# EAGLE design roboteagle_try2final (EAGLE 5.00)
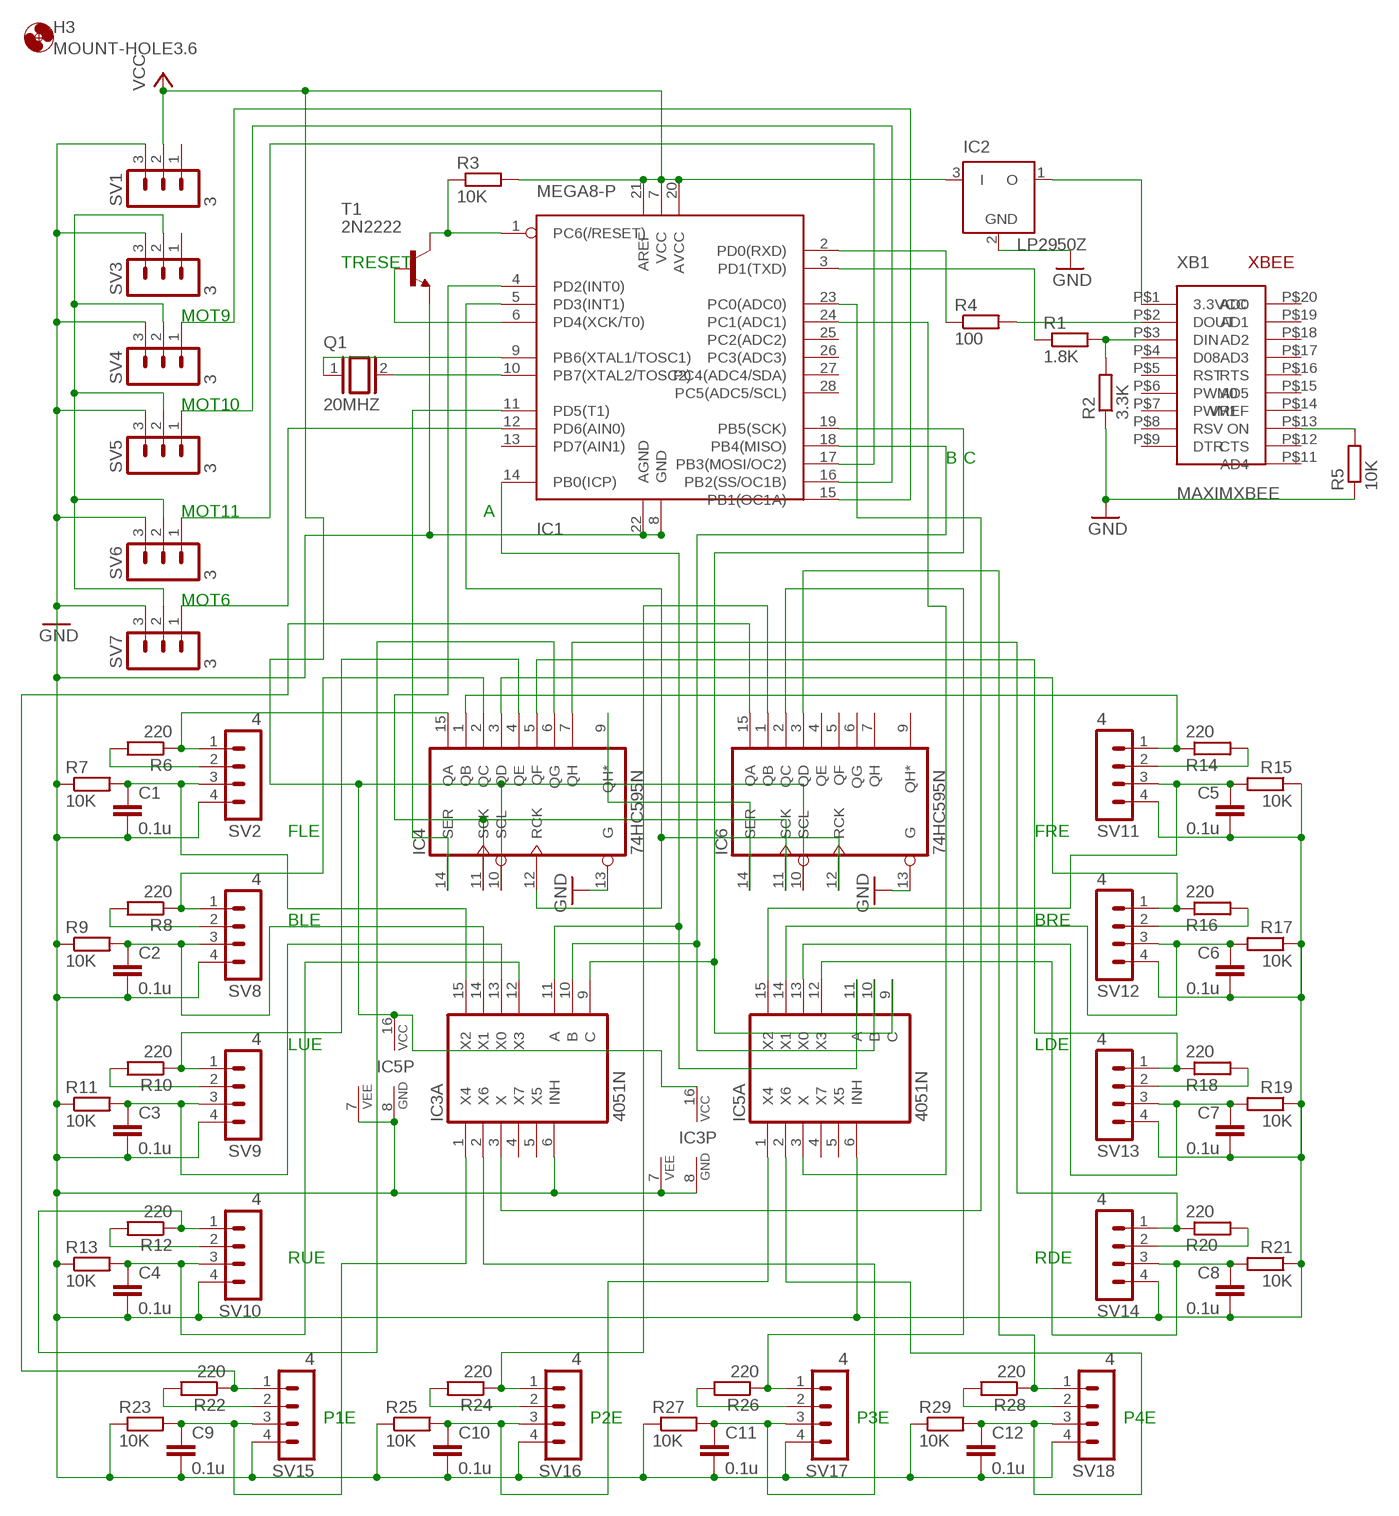
[diagram p0: schematic, sheet 1]

## Parts
C1  0.1u  C2.5/2  [C2.5-2]
C2  0.1u  C2.5/2  [C2.5-2]
C3  0.1u  C2.5/2  [C2.5-2]
C4  0.1u  C2.5/2  [C2.5-2]
C5  0.1u  C2.5/2  [C2.5-2]
C6  0.1u  C2.5/2  [C2.5-2]
C7  0.1u  C2.5/2  [C2.5-2]
C8  0.1u  C2.5/2  [C2.5-2]
C9  0.1u  C2.5/2  [C2.5-2]
C10  0.1u  C2.5/2  [C2.5-2]
C11  0.1u  C2.5/2  [C2.5-2]
C12  0.1u  C2.5/2  [C2.5-2]
H3  MOUNT-HOLE3.6  [3,6]
IC1  MEGA8-P  [DIL28-3]
IC2  LP2950Z  [TO92]
IC3  4051N  [DIL16]
IC4  74HC595N  [DIL16]
IC5  4051N  [DIL16]
IC6  74HC595N  [DIL16]
Q1  20MHZ  XTAL  [Q]
R1  1.8K  R-EU_0207/10  [0207/10]
R2  3.3K  R-EU_0207/10  [0207/10]
R3  10K  R-EU_0207/10  [0207/10]
R4  100  R-EU_0207/10  [0207/10]
R5  10K  R-EU_0207/10  [0207/10]
R6  220  R-EU_0207/10  [0207/10]
R7  10K  R-EU_0207/10  [0207/10]
R8  220  R-EU_0207/10  [0207/10]
R9  10K  R-EU_0207/10  [0207/10]
R10  220  R-EU_0207/10  [0207/10]
R11  10K  R-EU_0207/10  [0207/10]
R12  220  R-EU_0207/10  [0207/10]
R13  10K  R-EU_0207/10  [0207/10]
R14  220  R-EU_0207/10  [0207/10]
R15  10K  R-EU_0207/10  [0207/10]
R16  220  R-EU_0207/10  [0207/10]
R17  10K  R-EU_0207/10  [0207/10]
R18  220  R-EU_0207/10  [0207/10]
R19  10K  R-EU_0207/10  [0207/10]
R20  220  R-EU_0207/10  [0207/10]
R21  10K  R-EU_0207/10  [0207/10]
R22  220  R-EU_0207/10  [0207/10]
R23  10K  R-EU_0207/10  [0207/10]
R24  220  R-EU_0207/10  [0207/10]
R25  10K  R-EU_0207/10  [0207/10]
R26  220  R-EU_0207/10  [0207/10]
R27  10K  R-EU_0207/10  [0207/10]
R28  220  R-EU_0207/10  [0207/10]
R29  10K  R-EU_0207/10  [0207/10]
SV1  3  MA03-1  [MA03-1]
SV2  4  MA04-1  [MA04-1]
SV3  3  MA03-1  [MA03-1]
SV4  3  MA03-1  [MA03-1]
SV5  3  MA03-1  [MA03-1]
SV6  3  MA03-1  [MA03-1]
SV7  3  MA03-1  [MA03-1]
SV8  4  MA04-1  [MA04-1]
SV9  4  MA04-1  [MA04-1]
SV10  4  MA04-1  [MA04-1]
SV11  4  MA04-1  [MA04-1]
SV12  4  MA04-1  [MA04-1]
SV13  4  MA04-1  [MA04-1]
SV14  4  MA04-1  [MA04-1]
SV15  4  MA04-1  [MA04-1]
SV16  4  MA04-1  [MA04-1]
SV17  4  MA04-1  [MA04-1]
SV18  4  MA04-1  [MA04-1]
T1  2N2222  [TO18]
XB1  MAXIMXBEE  [DIL2051]

## Nets
3.3V: IC2.1(O) XB1.P$1(3.3VCC)
6V: SV3.2 SV4.2 SV5.2 SV6.2 SV7.2
A: IC1.14(PB0(ICP)) IC3.11(A:A) IC5.11(A:A)
A0: IC1.23(PC0(ADC0)) IC3.3(A:X)
A1: IC1.24(PC1(ADC1)) IC5.3(A:X)
B: IC1.18(PB4(MISO)) IC3.10(A:B) IC5.10(A:B)
BLA: R8.2 SV8.2
BLC: IC4.2(QC) R8.1 SV8.1
BLE: C2.1 IC3.14(A:X1) R9.2 SV8.3
BRE: C6.1 IC5.14(A:X1) R17.2 SV12.3
C: IC1.19(PB5(SCK)) IC3.9(A:C) IC5.9(A:C)
CLK: IC1.4(PD2(INT0)) IC4.11(SCK) IC6.11(SCK)
DATA: IC1.11(PD5(T1)) IC4.14(SER)
FLA: R6.2 SV2.2
FLC: IC4.15(QA) R6.1 SV2.1
FLE: C1.1 IC3.15(A:X2) R7.2 SV2.3
FRC: IC4.1(QB) R14.1 SV11.1
FRE: C5.1 IC5.15(A:X2) R15.2 SV11.3
GND: C1.2 C2.2 C3.2 C4.2 C5.2 C6.2 C7.2 C8.2 C9.2 C10.2 C11.2 C12.2 IC1.8(GND) IC1.22(AGND) IC2.2(GND) IC3.6(A:INH) IC3.7(P:VEE) IC3.8(P:GND) IC4.13(G) IC5.6(A:INH) IC5.7(P:VEE) IC5.8(P:GND) IC6.13(G) R2.1 R5.1 R7.1 R9.1 R11.1 R13.1 R15.1 R17.1 R19.1 R21.1 R23.1 R25.1 R27.1 R29.1 SV1.3 SV2.4 SV3.3 SV4.3 SV5.3 SV6.3 SV7.3 SV8.4 SV9.4 SV10.4 SV11.4 SV12.4 SV13.4 SV14.4 SV15.4 SV16.4 SV17.4 SV18.4 T1.1(E)
LATCH: IC1.5(PD3(INT1)) IC4.12(RCK) IC6.12(RCK)
LDA: R18.2 SV13.2
LDC: IC4.5(QF) R18.1 SV13.1
LDE: C7.1 IC5.13(A:X0) R19.2 SV13.3
LUA: R10.2 SV9.2
LUC: IC4.4(QE) R10.1 SV9.1
LUE: C3.1 IC3.13(A:X0) R11.2 SV9.3
MOT6: IC1.12(PD6(AIN0)) SV7.1
MOT9: IC1.15(PB1(OC1A)) SV4.1
MOT10: IC1.16(PB2(SS/OC1B)) SV5.1
MOT11: IC1.17(PB3(MOSI/OC2)) SV6.1
MRX: IC1.2(PD0(RXD)) R4.1
MTX: IC1.3(PD1(TXD)) R1.1
N$38: IC4.3(QD) R16.1 SV12.1
N$39: R16.2 SV12.2
N$71: R14.2 SV11.2
OSC1: IC1.9(PB6(XTAL1/TOSC1)) Q1.1
OSC2: IC1.10(PB7(XTAL2/TOSC2)) Q1.2
P1A: R22.2 SV15.2
P1C: IC6.15(QA) R22.1 SV15.1
P1E: C9.1 IC3.1(A:X4) R23.2 SV15.3
P2A: R24.2 SV16.2
P2C: IC6.1(QB) R24.1 SV16.1
P2E: C10.1 IC5.1(A:X4) R25.2 SV16.3
P3A: R26.2 SV17.2
P3C: IC6.2(QC) R26.1 SV17.1
P3E: C11.1 IC3.2(A:X6) R27.2 SV17.3
P4A: R28.2 SV18.2
P4C: IC6.3(QD) R28.1 SV18.1
P4E: C12.1 IC5.2(A:X6) R29.2 SV18.3
RDA: R20.2 SV14.2
RDC: IC4.7(QH) R20.1 SV14.1
RDE: C8.1 IC5.12(A:X3) R21.2 SV14.3
RST: IC1.1(PC6(/RESET)) R3.1 T1.3(C)
RUA: R12.2 SV10.2
RUC: IC4.6(QG) R12.1 SV10.1
RUE: C4.1 IC3.12(A:X3) R13.2 SV10.3
SEROUT: IC4.9(QH*) IC6.14(SER)
TRANSRST: IC1.6(PD4(XCK/T0)) T1.2(B)
VCC: IC1.7(VCC) IC1.20(AVCC) IC1.21(AREF) IC2.3(I) IC3.16(P:VCC) IC4.10(SCL) IC5.16(P:VCC) IC6.10(SCL) R3.2 SV1.2
XBDIN: R1.2 R2.2 XB1.P$3(DIN)
XBDOUT: R4.2 XB1.P$2(DOUT)
XBON: R5.2 XB1.P$13(ON)
Unconnected: IC1.13(PD7(AIN1)) IC1.25(PC2(ADC2)) IC1.26(PC3(ADC3)) IC1.27(PC4(ADC4/SDA)) IC1.28(PC5(ADC5/SCL)) IC3.4(A:X7) IC3.5(A:X5) IC5.4(A:X7) IC5.5(A:X5) IC6.4(QE) IC6.5(QF) IC6.6(QG) IC6.7(QH) IC6.9(QH*) SV1.1 SV3.1 XB1.P$4(D08) XB1.P$5(RST) XB1.P$6(PWM0) XB1.P$7(PWM1) XB1.P$8(RSV) XB1.P$9(DTR) XB1.P$11(AD4) XB1.P$12(CTS) XB1.P$14(VREF) XB1.P$15(AD5) XB1.P$16(RTS) XB1.P$17(AD3) XB1.P$18(AD2) XB1.P$19(AD1) XB1.P$20(AD0)

## Notes on the sheet
- TRESET
- MOT9
- MOT10
- B | C
- MOT11 | A
- MOT6
- FLE | FRE
- BLE | BRE
- LUE | LDE
- RUE | RDE
- P1E | P2E | P3E | P4E

## Power pins joined to a net without a drawn wire
GND: IC4.8(GND) IC6.8(GND) XB1.P$10(GND)
VCC: IC4.16(VCC) IC6.16(VCC)

## Library data of the parts
C1-C12 = capacitor-wima:C: CAPACITOR naming: grid - package width
H3 = holes:MOUNT-HOLE: MOUNTING HOLE with drill center marker
IC1 = atmel:MEGA8-P: MICROCONTROLLER 8 Kbytes FLASH, 1 kbytes SRAM, 512 bytes EEPROM, USART, 4-channel 10 bit ADC, 2-channel 8 bit ADC Pin compatible with Atmega48, ATMega88, ATMega168 Source: avr.lbr
IC2 = linear:LP2950: 100 mA, Low Power Low Dropout Voltage Regulator Source: http://www.onsemi.com/pub/Collateral/LP2950-D.PDF
IC3 IC5 = 40xx:4051: 8-channel ANALOG MULTIPLEXER
IC4 IC6 = 74xx-eu:74*595: 8-bit SHIFT REGISTER, output latch
Q1 = special:XTAL: CRYSTAL
R1-R29 = resistor:R-EU_: RESISTOR, European symbol
SV1 SV3-SV7 = con-lstb:MA03-1: PIN HEADER
SV2 SV8-SV18 = con-lstb:MA04-1: PIN HEADER
T1 = transistor:2N2222: NPN TRANSISTOR
XB1 = XBEE:MAXIMXBEE

## Board
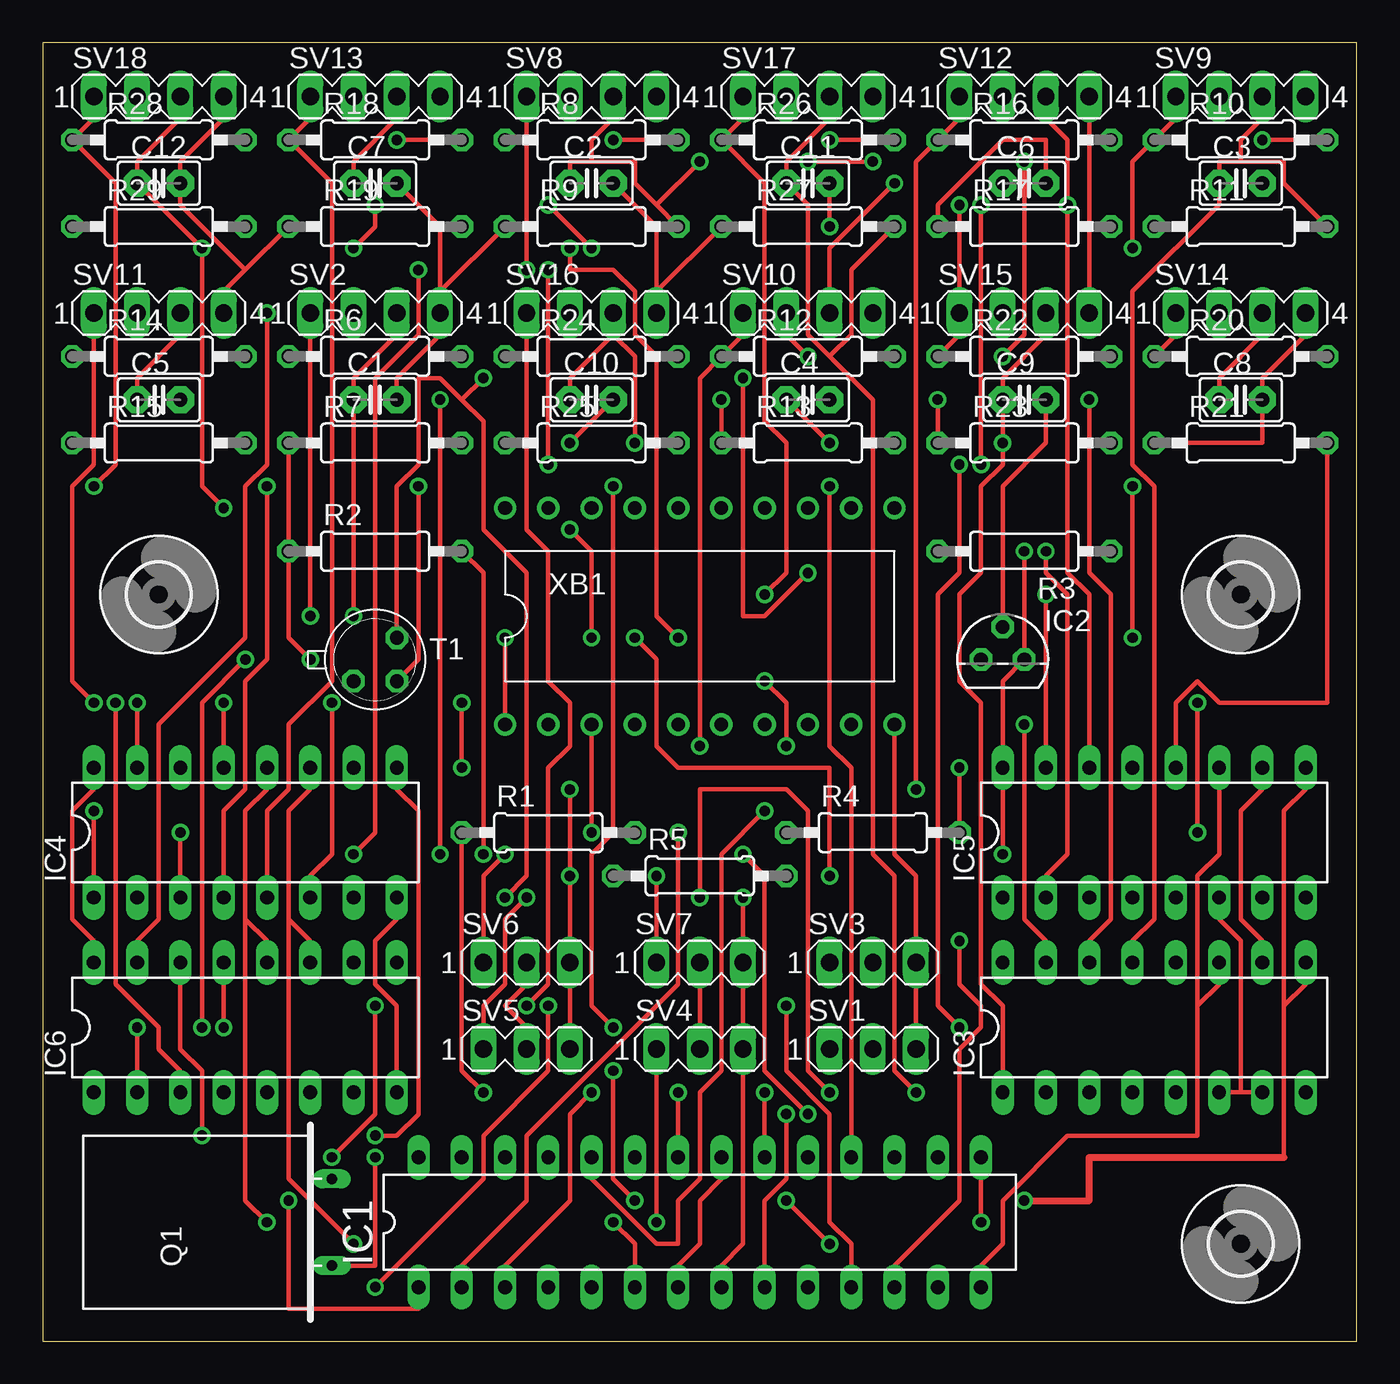
[diagram p1: board, top side]
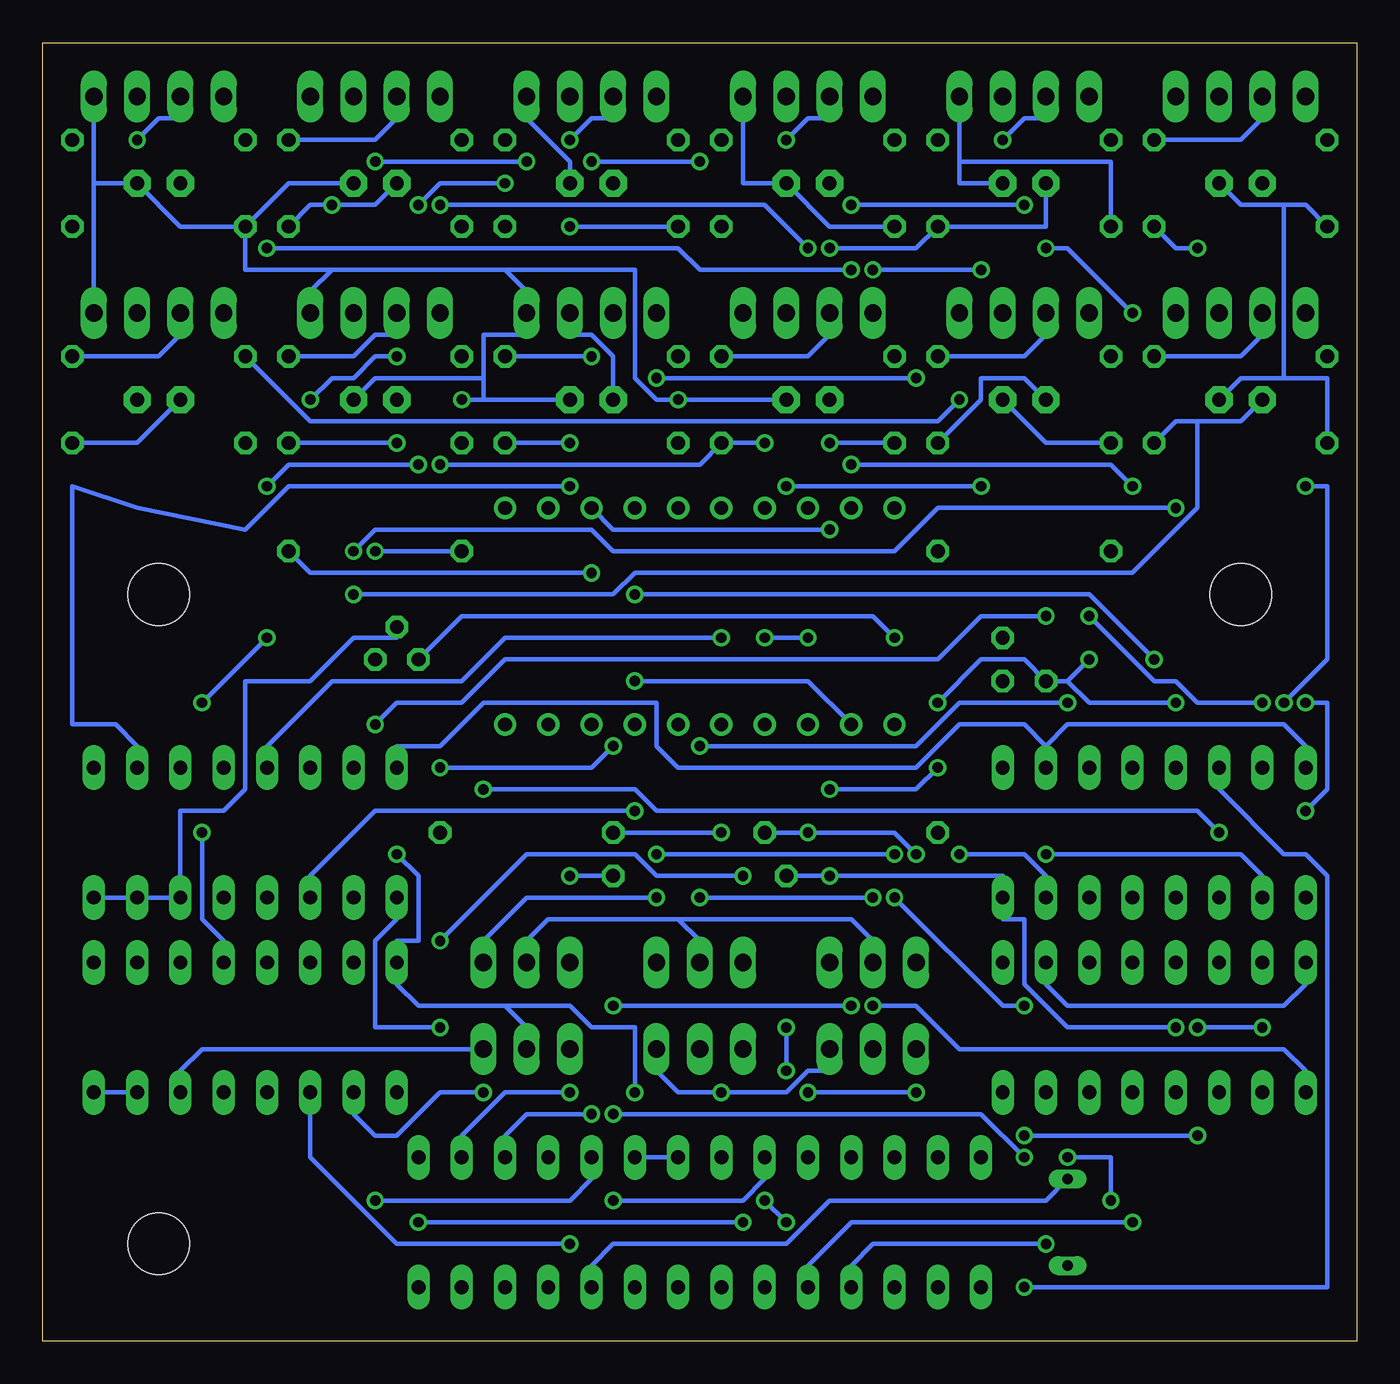
[diagram p2: board, bottom side, seen from below]

Size 77.14 x 76.19 mm. Coordinates in mm from the lower left corner, seen from the top.
Outline: 0,0 77.14,0 77.14,76.19 0,76.19 0,0
Copper layers (1*16): Top 0.035mm / dielectric 1.5mm / Bottom 0.035mm
Design rules "default": minimum track width 10mil, minimum drill 24mil, track to track 8mil, track to pad 8mil, pad to pad 8mil, via to via 8mil, smd to smd 8mil, copper to edge 40mil, drill to drill 8mil, minimum pad ring 10mil, minimum via ring 8mil, stop-mask expansion 4mil, vias tented up to drill 0mil, thermal gap 10mil

### Footprints (pad centres in the part's own frame; a part is rotated, then mirrored left to right if it is on the bottom)
C2.5-2 = drill 0.813 pad 1.6 octagon: 1 -1.27,0; 2 1.27,0
3,6 = hole 3.6: 0,0
DIL28-3 = drill 0.813 long: 1 -16.51,-3.81; 2 -13.97,-3.81; 3 -11.43,-3.81; 4 -8.89,-3.81; 5 -6.35,-3.81; 6 -3.81,-3.81; 7 -1.27,-3.81; 8 1.27,-3.81; 9 3.81,-3.81; 10 6.35,-3.81; 11 8.89,-3.81; 12 11.43,-3.81; 13 13.97,-3.81; 14 16.51,-3.81; 15 16.51,3.81; 16 13.97,3.81; 17 11.43,3.81; 18 8.89,3.81; 19 6.35,3.81; 20 3.81,3.81; 21 1.27,3.81; 22 -1.27,3.81; 23 -3.81,3.81; 24 -6.35,3.81; 25 -8.89,3.81; 26 -11.43,3.81; 27 -13.97,3.81; 28 -16.51,3.81
TO92 = drill 0.813 octagon: 1 -1.27,0; 2 0,1.905; 3 1.27,0
DIL16 = drill 0.813 long: 1 -8.89,-3.81; 2 -6.35,-3.81; 3 -3.81,-3.81; 4 -1.27,-3.81; 5 1.27,-3.81; 6 3.81,-3.81; 7 6.35,-3.81; 8 8.89,-3.81; 9 8.89,3.81; 10 6.35,3.81; 11 3.81,3.81; 12 1.27,3.81; 13 -1.27,3.81; 14 -3.81,3.81; 15 -6.35,3.81; 16 -8.89,3.81
Q = drill 0.61 long: 1 -2.54,-7.62; 2 2.54,-7.62
0207/10 = drill 0.813 octagon: 1 -5.08,0; 2 5.08,0
MA03-1 = drill 1.016 long: 1 -2.54,0; 2 0,0; 3 2.54,0
MA04-1 = drill 1.016 long: 1 -3.81,0; 2 -1.27,0; 3 1.27,0; 4 3.81,0
TO18 = drill 0.813 octagon: 1 -1.27,-1.27; 2 1.27,-1.27; 3 1.27,1.27
DIL2051 = drill 0.8 round: P$1 -12.7,-5.08; P$2 -10.16,-5.08; P$3 -7.62,-5.08; P$4 -5.08,-5.08; P$5 -2.54,-5.08; P$6 0,-5.08; P$7 2.54,-5.08; P$8 5.08,-5.08; P$9 7.62,-5.08; P$10 10.16,-5.08; P$11 10.16,7.62; P$12 7.62,7.62; P$13 5.08,7.62; P$14 2.54,7.62; P$15 0,7.62; P$16 -2.54,7.62; P$17 -5.08,7.62; P$18 -7.62,7.62; P$19 -10.16,7.62; P$20 -12.7,7.62

### Placement (x,y rotation side)
C1  19.52,55.24 0 top
C2  32.22,67.94 0 top
C3  70.32,67.94 0 top
C4  44.92,55.24 0 top
C5  6.82,55.24 0 top
C6  57.62,67.94 0 top
C7  19.52,67.94 0 top
C8  70.32,55.24 0 top
C9  57.62,55.24 0 top
C10  32.22,55.24 0 top
C11  44.92,67.94 0 top
C12  6.82,67.94 0 top
H1  MOUNT-HOLE3.6  [3,6]  6.82,43.81 0 top
H2  MOUNT-HOLE3.6  [3,6]  70.32,43.81 0 top
H3  70.32,5.71 0 top
IC1  38.57,6.98 0 top
IC2  56.35,40 0 top
IC3  65.24,18.41 0 top
IC4  11.9,29.84 0 top
IC5  65.24,29.84 0 top
IC6  11.9,18.41 0 top
Q1  9.36,6.98 90 top
R1  29.68,29.84 0 top
R2  19.52,46.35 0 top
R3  57.62,46.35 180 top
R4  48.73,29.84 0 top
R5  38.57,27.3 0 top
R6  19.52,57.78 0 top
R7  19.52,52.7 0 top
R8  32.22,70.48 0 top
R9  32.22,65.4 0 top
R10  70.32,70.48 0 top
R11  70.32,65.4 0 top
R12  44.92,57.78 0 top
R13  44.92,52.7 0 top
R14  6.82,57.78 0 top
R15  6.82,52.7 0 top
R16  57.62,70.48 0 top
R17  57.62,65.4 0 top
R18  19.52,70.48 0 top
R19  19.52,65.4 0 top
R20  70.32,57.78 0 top
R21  70.32,52.7 0 top
R22  57.62,57.78 0 top
R23  57.62,52.7 0 top
R24  32.22,57.78 0 top
R25  32.22,52.7 0 top
R26  44.92,70.48 0 top
R27  44.92,65.4 0 top
R28  6.82,70.48 0 top
R29  6.82,65.4 0 top
SV1  48.73,17.14 0 top
SV2  19.52,60.32 0 top
SV3  48.73,22.22 0 top
SV4  38.57,17.14 0 top
SV5  28.41,17.14 0 top
SV6  28.41,22.22 0 top
SV7  38.57,22.22 0 top
SV8  32.22,73.02 0 top
SV9  70.32,73.02 0 top
SV10  44.92,60.32 0 top
SV11  6.82,60.32 0 top
SV12  57.62,73.02 0 top
SV13  19.52,73.02 0 top
SV14  70.32,60.32 0 top
SV15  57.62,60.32 0 top
SV16  32.22,60.32 0 top
SV17  44.92,73.02 0 top
SV18  6.82,73.02 0 top
T1  19.52,40 0 top
XB1  39.84,41.27 0 top

### Tracks (layer width: path | path; a pad name or v marks a point on that pad's centre or on a via)
3.3V  (via drill 0.61)
  Top 0.254: XB1.P$1 v27.14,41.27
  Bottom 0.254: v27.14,41.27 28.41,42.54 52.54,42.54 IC2.1
6V
  Top 0.254: SV5.2 28.41,18.41 27.14,19.68 28.41,20.95 SV6.2 | SV7.2 SV4.2
  Bottom 0.254: 39.84,24.76 47.46,24.76 48.73,23.49 SV3.2 | 39.84,24.76 38.57,23.49 SV7.2 | 39.84,24.76 29.68,24.76 28.41,23.49 SV6.2
A
  Top 0.254: 67.78,19.68 67.78,12.06 60.16,12.06 56.35,8.25 56.35,5.71 55.08,4.44 IC1.14 | 67.78,19.68 69.05,20.95 IC3.11 | 67.78,19.68 67.78,27.3 69.05,28.57 IC5.11
A0  (via drill 0.61)
  Top 0.254: v43.65,8.25 v46.19,5.71
  Bottom 0.254: v43.65,8.25 36.03,8.25 34.76,9.52 IC1.23 | v46.19,5.71 56.35,5.71 61.43,10.79 IC3.3
A1  (via drill 0.61)
  Top 0.254: v42.38,31.11 39.84,28.57 39.84,15.87 38.57,14.6 38.57,9.52 37.3,8.25 37.3,5.71 36.03,5.71 32.22,9.52 IC1.24
  Bottom 0.254: v42.38,31.11 57.62,31.11 61.43,27.3 IC5.3
B  (via drill 0.61)
  Top 0.254: v46.19,50.16 46.19,34.92 47.46,33.65 IC1.18 | IC3.10 71.59,23.49 70.32,24.76 70.32,31.11 71.59,32.38 IC5.10
  Bottom 0.254: v46.19,50.16 62.7,50.16 65.24,47.62 71.59,48.89 75.4,50.16 75.4,36.19 72.86,36.19 71.59,34.92 IC5.10
BLA  (via drill 0.61)
  Top 0.254: v33.49,70.48 R8.2
  Bottom 0.254: v33.49,70.48 32.22,71.75 30.95,71.75 SV8.2
BLC  (via drill 0.61)
  Top 0.254: v18.25,28.57 19.52,29.84 19.52,56.51 22.06,59.05 v22.06,62.86 | v28.41,62.86 28.41,70.48 | 28.41,70.48 SV8.1 | 28.41,70.48 R8.1
  Bottom 0.254: v18.25,28.57 6.82,28.57 5.55,27.3 IC4.2 | v22.06,62.86 v28.41,62.86
BLE  (via drill 0.61)
  Top 0.254: 36.03,66.67 34.76,67.94 34.76,69.21 32.22,69.21 | 36.03,66.67 R9.2 | 32.22,69.21 30.95,69.21 C2.1 | v61.43,55.24 61.43,45.08 62.7,43.81 62.7,24.76 61.43,23.49 IC3.14 | v56.35,57.78 57.62,59.05 v57.62,69.21 | v48.73,69.21 v44.92,69.21 | v38.57,69.21 36.03,66.67 | 32.22,69.21 32.22,70.48 33.49,71.75 SV8.3
  Bottom 0.254: v61.43,55.24 60.16,56.51 58.89,56.51 57.62,57.78 v56.35,57.78 | v57.62,69.21 v48.73,69.21 | v44.92,69.21 v38.57,69.21
BRE  (via drill 0.61)
  Top 0.254: IC5.14 61.43,43.81 60.16,45.08 v60.16,66.67 60.16,70.48 58.89,71.75 SV12.3
  Bottom 0.254: R17.2 61.43,66.67 v60.16,66.67 57.62,66.67 C6.1
C  (via drill 0.61)
  Top 0.254: 72.86,10.79 72.86,19.68 | 72.86,19.68 74.13,20.95 IC3.9 | 72.86,19.68 72.86,31.11 74.13,32.38 IC5.9
  Top 0.406: v57.62,8.25 61.43,8.25 61.43,10.79 72.86,10.79
  Bottom 0.254: v57.62,8.25 46.19,8.25 44.92,9.52 IC1.19
CLK  (via drill 0.61)
  Top 0.254: 14.44,24.76 15.71,23.49 IC6.11 | 14.44,24.76 14.44,31.11 15.71,32.38 IC4.11 | v18.25,5.71 14.44,9.52 14.44,24.76
  Bottom 0.254: v18.25,5.71 28.41,5.71 29.68,4.44 IC1.4
DATA  (via drill 0.61)
  Top 0.254: v19.52,3.17 25.87,9.52 25.87,12.06 29.68,15.87 v29.68,19.68 | v43.65,19.68 43.65,15.87 46.19,13.33 46.19,6.98 47.46,5.71 IC1.11
  Bottom 0.254: v19.52,3.17 1.74,3.17 1.74,27.3 3.01,28.57 4.28,28.57 8.09,32.38 IC4.14 | v29.68,19.68 v43.65,19.68
FLA
  Bottom 0.254: R6.2 19.52,57.78 18.25,59.05 SV2.2
FLC  (via drill 0.61)
  Top 0.254: v15.71,42.54 15.71,57.78 | IC4.15 v5.55,37.46 | 15.71,57.78 SV2.1 | 15.71,57.78 R6.1
  Bottom 0.254: v5.55,37.46 9.36,37.46 10.63,38.73 11.9,38.73 v15.71,42.54
FLE  (via drill 0.61)
  Top 0.254: v57.62,36.19 57.62,24.76 58.89,23.49 IC3.15 | v18.25,42.54 C1.1 18.25,56.51 20.79,59.05 SV2.3
  Bottom 0.254: R7.2 22.06,55.24 22.06,56.51 19.52,56.51 C1.1 | v57.62,36.19 56.35,37.46 52.54,37.46 50,40 24.6,40 22.06,42.54 v18.25,42.54
FRC  (via drill 0.61)
  Top 0.254: v3.01,37.46 1.74,38.73 1.74,50.16 3.01,51.43 3.01,57.78 | IC4.1 v3.01,31.11 | 3.01,57.78 SV11.1 | 3.01,57.78 R14.1
  Bottom 0.254: v3.01,31.11 1.74,32.38 1.74,37.46 v3.01,37.46
FRE  (via drill 0.61)
  Top 0.254: v58.89,43.81 IC5.15 | C5.1 5.55,56.51 8.09,59.05 SV11.3
  Bottom 0.254: R15.2 10.63,53.97 9.36,53.97 | 9.36,53.97 6.82,53.97 C5.1 | v58.89,43.81 43.65,43.81 42.38,45.08 13.17,45.08 9.36,48.89 9.36,53.97
GND  (via drill 0.61)
  Top 0.254: 11.9,62.86 10.63,61.59 SV11.4 | R19.1 11.9,62.86 | SV18.4 10.63,71.75 8.09,69.21 C12.2 8.09,66.67 11.9,62.86 | 36.03,61.59 R27.1 | C2.2 36.03,65.4 36.03,61.59 | 36.03,61.59 SV16.4 | v46.19,65.4 C11.2 | 23.33,61.59 R9.1 | C7.2 23.33,65.4 23.33,61.59 | 23.33,61.59 SV2.4 23.33,59.05 20.79,56.51 C1.2 | v10.63,37.46 IC4.13 | R7.1 R2.1 14.44,41.27 v15.71,40 | SV5.3 SV6.3 v30.95,27.3 v30.95,32.38 | v37.3,14.6 IC1.22 | IC1.8 39.84,4.44 41.11,5.71 SV4.3 SV7.3 v41.11,26.03 | IC6.8 20.79,19.68 19.52,20.95 19.52,23.49 20.79,24.76 IC4.8 | v10.63,18.41 IC6.13 | 70.32,14.6 IC3.7 | IC3.6 70.32,14.6 | XB1.P$10 50,28.57 51.27,27.3 SV3.3 SV1.3 | 70.32,14.6 70.32,23.49 69.05,24.76 IC5.6 | R21.1 71.59,52.7 C8.2 71.59,56.51 74.13,59.05 SV14.4 | C9.2 58.89,52.7 56.35,50.16 IC2.2 | R17.1 52.54,66.67 56.35,70.48 58.89,70.48 C6.2 | C10.2 v30.95,52.7 | v39.84,55.24 R13.1 | v52.54,55.24 R23.1 | SV15.4 SV12.4 | v24.6,33.65 v24.6,37.46
  Bottom 0.254: R15.1 1.74,56.51 4.28,56.51 | 4.28,56.51 6.82,56.51 C5.2 | R29.1 3.01,66.67 4.28,66.67 | 4.28,66.67 6.82,66.67 C12.2 | 4.28,66.67 4.28,56.51 | C11.2 46.19,69.21 48.73,71.75 SV17.4 | SV8.4 36.03,67.94 C2.2 30.95,65.4 R9.1 | R27.1 v46.19,65.4 | 23.33,69.21 23.33,67.94 C7.2 | 23.33,69.21 SV13.4 | v10.63,37.46 15.71,37.46 16.98,38.73 | 16.98,38.73 T1.1 19.52,40 22.06,40 v24.6,37.46 | C1.2 18.25,52.7 R7.1 | 16.98,38.73 v15.71,40 | R19.1 14.44,69.21 23.33,69.21 | SV4.3 41.11,15.87 39.84,14.6 v37.3,14.6 33.49,14.6 32.22,15.87 30.95,15.87 SV5.3 | v10.63,18.41 16.98,18.41 19.52,20.95 19.52,24.76 20.79,24.76 IC4.8 20.79,27.3 v30.95,27.3 R5.1 | IC5.8 IC5.7 IC5.6 69.05,31.11 66.51,31.11 65.24,32.38 65.24,38.73 61.43,38.73 58.89,41.27 56.35,41.27 IC2.2 | IC3.7 IC3.8 | SV1.3 67.78,17.14 69.05,15.87 IC3.6 | 74.13,67.94 C3.2 69.05,65.4 R11.1 | 74.13,67.94 SV9.4 | 74.13,67.94 SV14.4 | R11.1 62.7,67.94 C6.2 | v30.95,52.7 R25.1 | C10.2 v39.84,55.24 41.11,55.24 42.38,56.51 42.38,62.86 50,62.86 | 51.27,55.24 C4.2 | 51.27,55.24 v52.54,55.24 | 50,62.86 48.73,61.59 SV10.4 48.73,59.05 51.27,59.05 51.27,56.51 | 50,62.86 60.16,62.86 | 60.16,62.86 61.43,61.59 SV15.4 | 51.27,56.51 51.27,55.24 | R11.1 65.24,62.86 60.16,62.86 | C9.2 57.62,56.51 51.27,56.51 | v41.11,26.03 48.73,26.03 51.27,23.49 SV3.3 | v24.6,33.65 25.87,32.38 v30.95,32.38
LATCH  (via drill 0.61)
  Top 0.254: 11.9,24.76 13.17,23.49 IC6.12 | 11.9,24.76 11.9,31.11 13.17,32.38 IC4.12 | v13.17,6.98 11.9,8.25 11.9,24.76
  Bottom 0.254: v13.17,6.98 29.68,6.98 32.22,4.44 IC1.5
LDA  (via drill 0.61)
  Top 0.254: v20.79,70.48 R18.2
  Bottom 0.254: v20.79,70.48 19.52,71.75 18.25,71.75 SV13.2
LDC
  Top 0.254: IC4.5 13.17,31.11 14.44,32.38 14.44,36.19 16.98,38.73 16.98,67.94 R18.1 15.71,71.75 SV13.1
LDE  (via drill 0.61)
  Top 0.254: C7.1 18.25,69.21 20.79,71.75 SV13.3 | v37.3,41.27 36.03,42.54 36.03,57.78 34.76,59.05 34.76,61.59 33.49,62.86 30.95,62.86 v30.95,64.13
  Bottom 0.254: v37.3,41.27 50,41.27 52.54,38.73 60.16,38.73 63.97,34.92 IC5.13 | v30.95,64.13 25.87,64.13 R19.2 18.25,65.4 C7.1
LUA  (via drill 0.61)
  Top 0.254: v71.59,70.48 R10.2
  Bottom 0.254: v71.59,70.48 70.32,71.75 69.05,71.75 SV9.2
LUC  (via drill 0.61)
  Top 0.254: v13.17,50.16 13.17,40 11.9,38.73 11.9,32.38 10.63,31.11 IC4.4 | v29.68,51.43 v29.68,62.86 | v63.97,64.13 63.97,69.21 R10.1 66.51,71.75 SV9.1
  Bottom 0.254: v13.17,50.16 14.44,51.43 v29.68,51.43 | v29.68,62.86 38.57,62.86 39.84,64.13 v63.97,64.13
LUE
  Top 0.254: IC3.13 63.97,23.49 65.24,24.76 65.24,50.16 63.97,51.43 63.97,61.59 69.05,66.67 C3.1 69.05,69.21 70.32,69.21 | R11.2 72.86,67.94 72.86,69.21 70.32,69.21 | 70.32,69.21 70.32,70.48 71.59,71.75 SV9.3
MOT6  (via drill 0.61)
  Top 0.254: v53.81,23.49 53.81,20.95 55.08,19.68 55.08,18.41 53.81,17.14 53.81,8.25 50,4.44 IC1.12 | v36.03,27.3 SV7.1
  Bottom 0.254: v53.81,23.49 48.73,28.57 42.38,28.57 41.11,27.3 v36.03,27.3
MOT9  (via drill 0.61)
  Top 0.254: v55.08,6.98 IC1.15 | v36.03,6.98 SV4.1
  Bottom 0.254: v36.03,6.98 v55.08,6.98
MOT10  (via drill 0.61)
  Top 0.254: v46.19,14.6 44.92,15.87 44.92,31.11 43.65,32.38 38.57,32.38 v38.57,26.03 | v28.41,26.03 27.14,24.76 27.14,20.95 25.87,19.68 SV5.1
  Bottom 0.254: v46.19,14.6 50,14.6 52.54,12.06 IC1.16 | v28.41,26.03 v38.57,26.03
MOT11  (via drill 0.61)
  Top 0.254: v44.92,13.33 42.38,15.87 42.38,27.3 v41.11,28.57 | v27.14,28.57 25.87,27.3 SV6.1
  Bottom 0.254: v44.92,13.33 48.73,13.33 50,12.06 IC1.17 | v27.14,28.57 v41.11,28.57
MRX  (via drill 0.61)
  Top 0.254: v37.3,29.84 37.3,20.95 28.41,12.06 28.41,8.25 24.6,4.44 IC1.2
  Bottom 0.254: v37.3,29.84 R4.1
MTX  (via drill 0.61)
  Top 0.254: v32.22,14.6 30.95,13.33 30.95,8.25 27.14,4.44 IC1.3 | v25.87,14.6 24.6,15.87 R1.1
  Bottom 0.254: v32.22,14.6 v25.87,14.6
N$38  (via drill 0.61)
  Top 0.254: v51.27,32.38 51.27,69.21 R16.1 53.81,71.75 SV12.1 | IC4.3 v8.09,29.84
  Bottom 0.254: v8.09,29.84 9.36,31.11 41.11,31.11 42.38,32.38 v51.27,32.38
N$39
  Bottom 0.254: R16.2 57.62,70.48 56.35,71.75 SV12.2
N$71
  Bottom 0.254: R14.2 6.82,57.78 5.55,59.05 SV11.2
OSC1  (via drill 0.61)
  Top 0.254: Q1.1 19.52,4.44 v19.52,10.79 | v43.65,13.33 43.65,9.52 42.38,8.25 IC1.9
  Bottom 0.254: v19.52,10.79 22.06,13.33 v43.65,13.33
OSC2
  Bottom 0.254: Q1.2 18.25,8.25 30.95,8.25 33.49,5.71 43.65,5.71 44.92,4.44 IC1.10
P1A
  Bottom 0.254: R22.2 58.89,57.78 57.62,59.05 56.35,59.05 SV15.2
P1C  (via drill 0.61)
  Top 0.254: v13.17,60.32 13.17,51.43 11.9,50.16 11.9,41.27 6.82,36.19 6.82,24.76 5.55,23.49 IC6.15 | v18.25,64.13 19.52,65.4 v19.52,66.67 | v29.68,66.67 v32.22,64.13 | v53.81,66.67 SV15.1 53.81,59.05 R22.1
  Bottom 0.254: v13.17,60.32 16.98,64.13 v18.25,64.13 | v19.52,66.67 v29.68,66.67 | v32.22,64.13 34.76,66.67 v53.81,66.67
P1E  (via drill 0.61)
  Top 0.254: IC3.1 56.35,19.68 55.08,20.95 55.08,37.46 53.81,38.73 53.81,43.81 55.08,45.08 55.08,50.16 56.35,51.43 v56.35,52.7 C9.1 56.35,56.51 58.89,59.05 SV15.3
  Bottom 0.254: v56.35,52.7 R23.2
P2A
  Bottom 0.254: R24.2 32.22,57.78 30.95,59.05 SV16.2
P2C  (via drill 0.61)
  Top 0.254: v28.41,19.68 29.68,20.95 29.68,33.65 30.95,34.92 30.95,37.46 29.68,38.73 29.68,46.35 28.41,47.62 28.41,57.78 | 28.41,57.78 SV16.1 | 28.41,57.78 R24.1
  Bottom 0.254: v28.41,19.68 25.87,19.68 23.33,17.14 4.28,17.14 3.01,15.87 IC6.1
P2E  (via drill 0.61)
  Top 0.254: 33.49,59.05 30.95,56.51 C10.1 | v53.81,18.41 52.54,19.68 52.54,43.81 53.81,45.08 v53.81,51.43 | 33.49,59.05 34.76,57.78 v34.76,52.7 | 33.49,59.05 SV16.3
  Bottom 0.254: v53.81,18.41 57.62,18.41 57.62,23.49 56.35,24.76 IC5.1 | v53.81,51.43 38.57,51.43 R25.2 v34.76,52.7
P3A  (via drill 0.61)
  Top 0.254: v46.19,70.48 R26.2
  Bottom 0.254: v46.19,70.48 44.92,71.75 43.65,71.75 SV17.2
P3C  (via drill 0.61)
  Top 0.254: v9.36,18.41 9.36,37.46 v11.9,40 | v42.38,43.81 43.65,45.08 43.65,52.7 42.38,53.97 42.38,67.94 R26.1 41.11,71.75 SV17.1 | IC6.2 v5.55,18.41
  Bottom 0.254: v5.55,18.41 v9.36,18.41 | v11.9,40 15.71,43.81 v42.38,43.81
P3E  (via drill 0.61)
  Top 0.254: R27.2 47.46,62.86 47.46,59.05 46.19,57.78 | 46.19,57.78 44.92,59.05 44.92,66.67 C11.1 43.65,69.21 46.19,71.75 SV17.3 | v51.27,14.6 50,15.87 50,27.3 48.73,28.57 48.73,55.24 46.19,57.78
  Bottom 0.254: v51.27,14.6 53.81,14.6 56.35,12.06 57.62,12.06 58.89,13.33 IC3.2
P4A
  Bottom 0.254: R28.2 6.82,70.48 5.55,71.75 SV18.2
P4C  (via drill 0.61)
  Top 0.254: v4.28,37.46 4.28,20.95 6.82,18.41 6.82,17.14 8.09,15.87 IC6.3 | v3.01,50.16 4.28,51.43 4.28,67.94 R28.1 3.01,71.75 SV18.1
  Bottom 0.254: v4.28,37.46 1.74,40 1.74,50.16 v3.01,50.16
P4E  (via drill 0.61)
  Top 0.254: v58.89,46.35 58.89,45.08 60.16,43.81 60.16,28.57 58.89,27.3 IC5.2 | v10.63,48.89 9.36,50.16 v9.36,64.13 C12.1 5.55,69.21 8.09,71.75 SV18.3
  Bottom 0.254: v58.89,46.35 57.62,47.62 44.92,47.62 43.65,46.35 27.14,46.35 24.6,48.89 v10.63,48.89 | R29.2 10.63,64.13 v9.36,64.13
RDA
  Bottom 0.254: R20.2 70.32,57.78 69.05,59.05 SV14.2
RDC  (via drill 0.61)
  Top 0.254: v23.33,28.57 v23.33,55.24 | R20.1 66.51,59.05 SV14.1
  Bottom 0.254: v23.33,28.57 19.52,28.57 18.25,27.3 IC4.7 | v23.33,55.24 24.6,53.97 61.43,53.97 R20.1
RDE
  Top 0.254: C8.1 69.05,56.51 71.59,59.05 SV14.3 | R21.2 75.4,37.46 69.05,37.46 67.78,38.73 66.51,37.46 IC5.12
  Bottom 0.254: C8.1 71.59,52.7 R21.2
RST  (via drill 0.61)
  Top 0.254: v14.44,8.25 14.44,1.9 22.06,1.9 IC1.1 | v16.98,10.79 19.52,13.33 v19.52,19.68 | v27.14,26.03 28.41,27.3 28.41,45.08 25.87,47.62 25.87,53.97 24.6,55.24 | 24.6,55.24 23.33,56.51 22.06,56.51 22.06,51.43 20.79,50.16 T1.3 | v44.92,45.08 42.38,42.54 41.11,42.54 v41.11,56.51 | 24.6,55.24 v25.87,56.51
  Bottom 0.254: v14.44,8.25 14.44,10.79 v16.98,10.79 | v19.52,19.68 20.79,19.68 v27.14,26.03 | R3.1 61.43,45.08 v44.92,45.08 | v25.87,56.51 v41.11,56.51
RUA  (via drill 0.61)
  Top 0.254: v44.92,57.78 43.65,59.05 SV10.2
  Bottom 0.254: v44.92,57.78 R12.2
RUC  (via drill 0.61)
  Top 0.254: v16.98,37.46 16.98,28.57 15.71,27.3 IC4.6 | v38.57,34.92 38.57,56.51 R12.1 41.11,59.05 SV10.1
  Bottom 0.254: v16.98,37.46 23.33,37.46 25.87,34.92 v38.57,34.92
RUE  (via drill 0.61)
  Top 0.254: C4.1 v46.19,52.7 | v67.78,29.84 v67.78,37.46 | v63.97,41.27 v63.97,50.16 | v55.08,51.43 v55.08,66.67 | v50,67.94 46.19,64.13 SV10.3
  Bottom 0.254: v46.19,52.7 R13.2 | v67.78,29.84 67.78,24.76 66.51,23.49 IC3.12 | v67.78,37.46 v63.97,41.27 | v63.97,50.16 62.7,51.43 v55.08,51.43 | v55.08,66.67 53.81,67.94 v50,67.94 | C4.1 43.65,57.78 44.92,59.05 46.19,59.05 SV10.3
SEROUT  (via drill 0.61)
  Top 0.254: v9.36,12.06 9.36,15.87 8.09,17.14 IC6.14 | v19.52,12.06 20.79,12.06 22.06,13.33 22.06,31.11 20.79,32.38 IC4.9
  Bottom 0.254: v9.36,12.06 v19.52,12.06
TRANSRST  (via drill 0.61)
  Top 0.254: T1.2 22.06,40 v22.06,50.16 | v33.49,50.16 33.49,29.84 32.22,28.57 32.22,19.68 v33.49,18.41 | v33.49,15.87 33.49,9.52 v34.76,8.25 | v33.49,6.98 34.76,5.71 IC1.6
  Bottom 0.254: v33.49,50.16 v22.06,50.16 | v33.49,15.87 v33.49,18.41 | v33.49,6.98 v34.76,8.25
VCC  (via drill 0.61)
  Top 0.254: IC6.16 3.01,23.49 1.74,24.76 1.74,31.11 3.01,32.38 IC4.16 | v57.62,46.35 IC2.3 56.35,38.73 IC5.16 v56.35,28.57 | IC1.7 37.3,4.44 38.57,5.71 38.57,8.25 39.84,9.52 IC1.21 | v42.38,14.6 IC1.20
  Bottom 0.254: IC6.10 18.25,20.95 16.98,19.68 4.28,19.68 3.01,20.95 IC6.16 | 18.25,34.92 16.98,36.19 4.28,36.19 3.01,34.92 IC4.16 | v57.62,46.35 R3.2 | IC1.20 IC1.21 | 50,19.68 55.08,19.68 56.35,20.95 IC3.16 56.35,23.49 55.08,23.49 55.08,27.3 v56.35,28.57 | 50,19.68 48.73,18.41 SV1.2 | v42.38,14.6 42.38,18.41 44.92,18.41 46.19,19.68 50,19.68 | 18.25,34.92 19.52,36.19 23.33,36.19 25.87,33.65 39.84,33.65 41.11,34.92 41.11,37.46 51.27,37.46 53.81,34.92 56.35,34.92 IC5.16 | 18.25,34.92 IC4.10
XBDIN  (via drill 0.61)
  Top 0.254: v32.22,29.84 XB1.P$3 | R2.2 25.87,45.08 v25.87,28.57
  Bottom 0.254: R1.2 v32.22,29.84 27.14,29.84 v25.87,28.57
XBDOUT  (via drill 0.61)
  Top 0.254: v42.38,38.73 43.65,37.46 v43.65,34.92 | v53.81,33.65 R4.2
  Bottom 0.254: XB1.P$2 32.22,38.73 v42.38,38.73 | v43.65,34.92 44.92,33.65 v53.81,33.65
XBON  (via drill 0.61)
  Top 0.254: v30.95,47.62 32.22,46.35 v32.22,41.27 | v34.76,41.27 36.03,40 36.03,34.92 37.3,33.65 46.19,33.65 v46.19,27.3
  Bottom 0.254: XB1.P$13 43.65,47.62 v30.95,47.62 | v34.76,41.27 v32.22,41.27 | R5.2 v46.19,27.3